# EAGLE schematic 433 mhz rf (EAGLE 9.6.2)
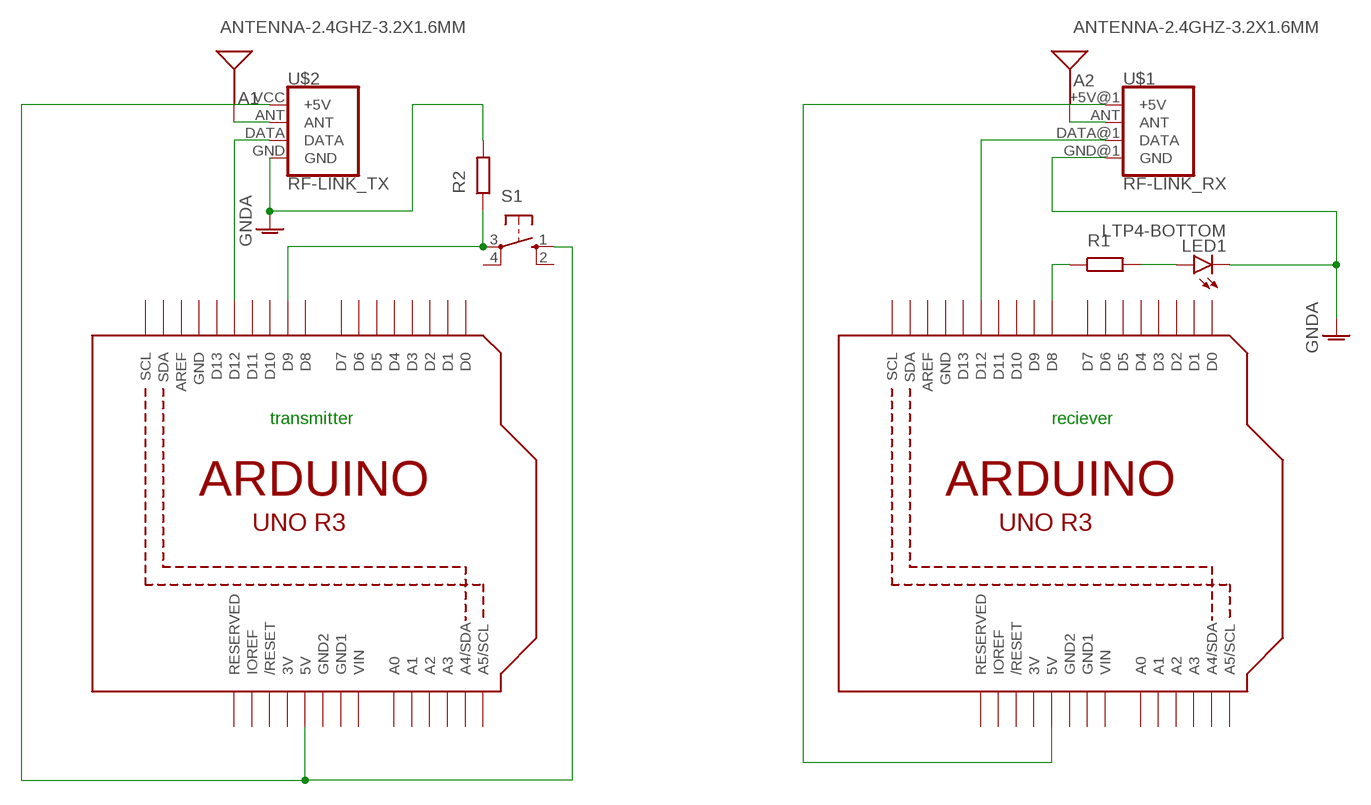
[diagram p0: schematic, sheet 1]

## Parts
A1  ANTENNA-2.4GHZ-3.2X1.6MM  [ANT-2.4GHZ-3.2X1.6X1.2MM]
A2  ANTENNA-2.4GHZ-3.2X1.6MM  [ANT-2.4GHZ-3.2X1.6X1.2MM]
LED1  LTP4-BOTTOM  [P47F-BOTTOM]
R1  R  (no package)
R2  R  (no package)
S1  40-XX  [B3F-40XX]
U1  ARDUINOR3-DIMENSION  [ARDUINOR3]
U2  ARDUINOR3-DIMENSION  [ARDUINOR3]
U$1  RF-LINK_RX  [RF-LINK_RX]
U$2  RF-LINK_TX  [RF-LINK_TX]

## Nets
GNDA: LED1.C R2.2 U$1.GND@1(GND) U$2.GND
N$2: A1.FEED(SIGNAL) U$2.ANT
N$3: A2.FEED(SIGNAL) U$1.ANT
N$4: U1.D12 U$2.DATA
N$5: R1.1 U2.D8
N$6: U2.D12 U$1.DATA@1(DATA)
N$7: U2.5V U$1.+5V@1(+5V)
N$8: LED1.A R1.2
N$9: S1.1(S) U1.5V U$2.VCC(+5V)
N$10: R2.1 S1.3(P) U1.D9
Unconnected: S1.2(S1) S1.4(P1) U1.A0 U1.A1 U1.A2 U1.A3 U1.A4(A4/SDA) U1.A5(A5/SCL) U1.AREF U1.D0 U1.D1 U1.D2 U1.D3 U1.D4 U1.D5 U1.D6 U1.D7 U1.D8 U1.D10 U1.D11 U1.D13 U1.IOREF U1.RESERVED U1.RESET(/RESET) U1.SCL U1.SDA U2.A0 U2.A1 U2.A2 U2.A3 U2.A4(A4/SDA) U2.A5(A5/SCL) U2.AREF U2.D0 U2.D1 U2.D2 U2.D3 U2.D4 U2.D5 U2.D6 U2.D7 U2.D9 U2.D10 U2.D11 U2.D13 U2.IOREF U2.RESERVED U2.RESET(/RESET) U2.SCL U2.SDA

## Notes on the sheet
- transmitter | reciever

## Power pins joined to a net without a drawn wire
3V: U1.3V U2.3V
GND: U1.GND U2.GND
GND1: U1.GND1 U2.GND1
GND2: U1.GND2 U2.GND2
VIN: U1.VIN U2.VIN

## Library data of the parts
A1 A2 = SparkFun-RF:ANTENNA: Single-ended Antennae 2.4GHz and antennae with just one terminal. These are all chip antennae. 2.4GHz (WiFi/BT/ZigBee) Antennae ANT-2.4GHZ-6.5X2.2MM - 6.5 x 2.2 mm chip antenna. (SparkFun Product <https://www.sparkfun.com/products/144>) ANT-2.4GHZ8.0X1.0MM - 8.0 x 1.0 mm chip antenna. (Datasheet <http://www.mouser.com/ds/2/611/antenna_2500at44m0400-242425.pdf>) ANT-2.4GHZ9.5X2.0MM - 9.5 x 2.0 mm chip antenna. (SparkFun Product <https://www.sparkfun.com/products/9025>); PROD_ID: ANT-14235
LED1 = led:*P4: PointLED® Enhanced Thinfilm LED TOP & BOTTOM mount LS P47F, LR P47F, LA P47F, LY P47F, LT P4SG, LB P4SG, LW P4SG Source: http://catalog.osram-os.com .. LA_LR_LS_LY_P47F_Pb_free.pdf
R1 R2 = ngspice-simulation:R: RESISTOR
S1 = adafruit:40-XX: OMRON SWITCH; MF: OMRON COMPONENTS USA; MPN: B3F-4000; OC_FARNELL: 176434; OC_NEWARK: 36K3105
U1 U2 = adafruit:ARDUINOR3: This is a new object for the new Arduino R3 - with extra pins that you may want to use (such as IOref, and duplicated A4/A5
U$1 = SparkFun-RF:RF-LINK_RX: RF Link Receiver (434 MHz, 315 MHz) These wireless receivers work with equivalent transmitters. They can easily fit into a breadboard and work well with microcontrollers to create a very simple wireless data link. Since these are only receivers, they will only work communicating data one-way, you would need two pairs (of different frequencies) to act as a transmitter/receiver pair.. SparkFun Products RF Link Receiver - 4800bps (434 MHz) <https://www.sparkfun.com/products/10532>(WRL-10532); SF_ID: WRL-10533
U$2 = SparkFun-RF:RF-LINK_TX: RF Link Transmitter (434 MHz, 315 MHz) These wireless transmitters work with equivalent receivers. They can easily fit into a breadboard and work well with microcontrollers to create a very simple wireless data link. Since these are only transmitters, they will only work communicating data one-way, you would need two pairs (of different frequencies) to act as a transmitter/receiver pair. SparkFun Products RF Link Transmitter - 434MHz <https://www.sparkfun.com/products/10534> (WRL-10534); SF_ID: WRL-10534